# EAGLE board Board_1_ (EAGLE 8.7.0)
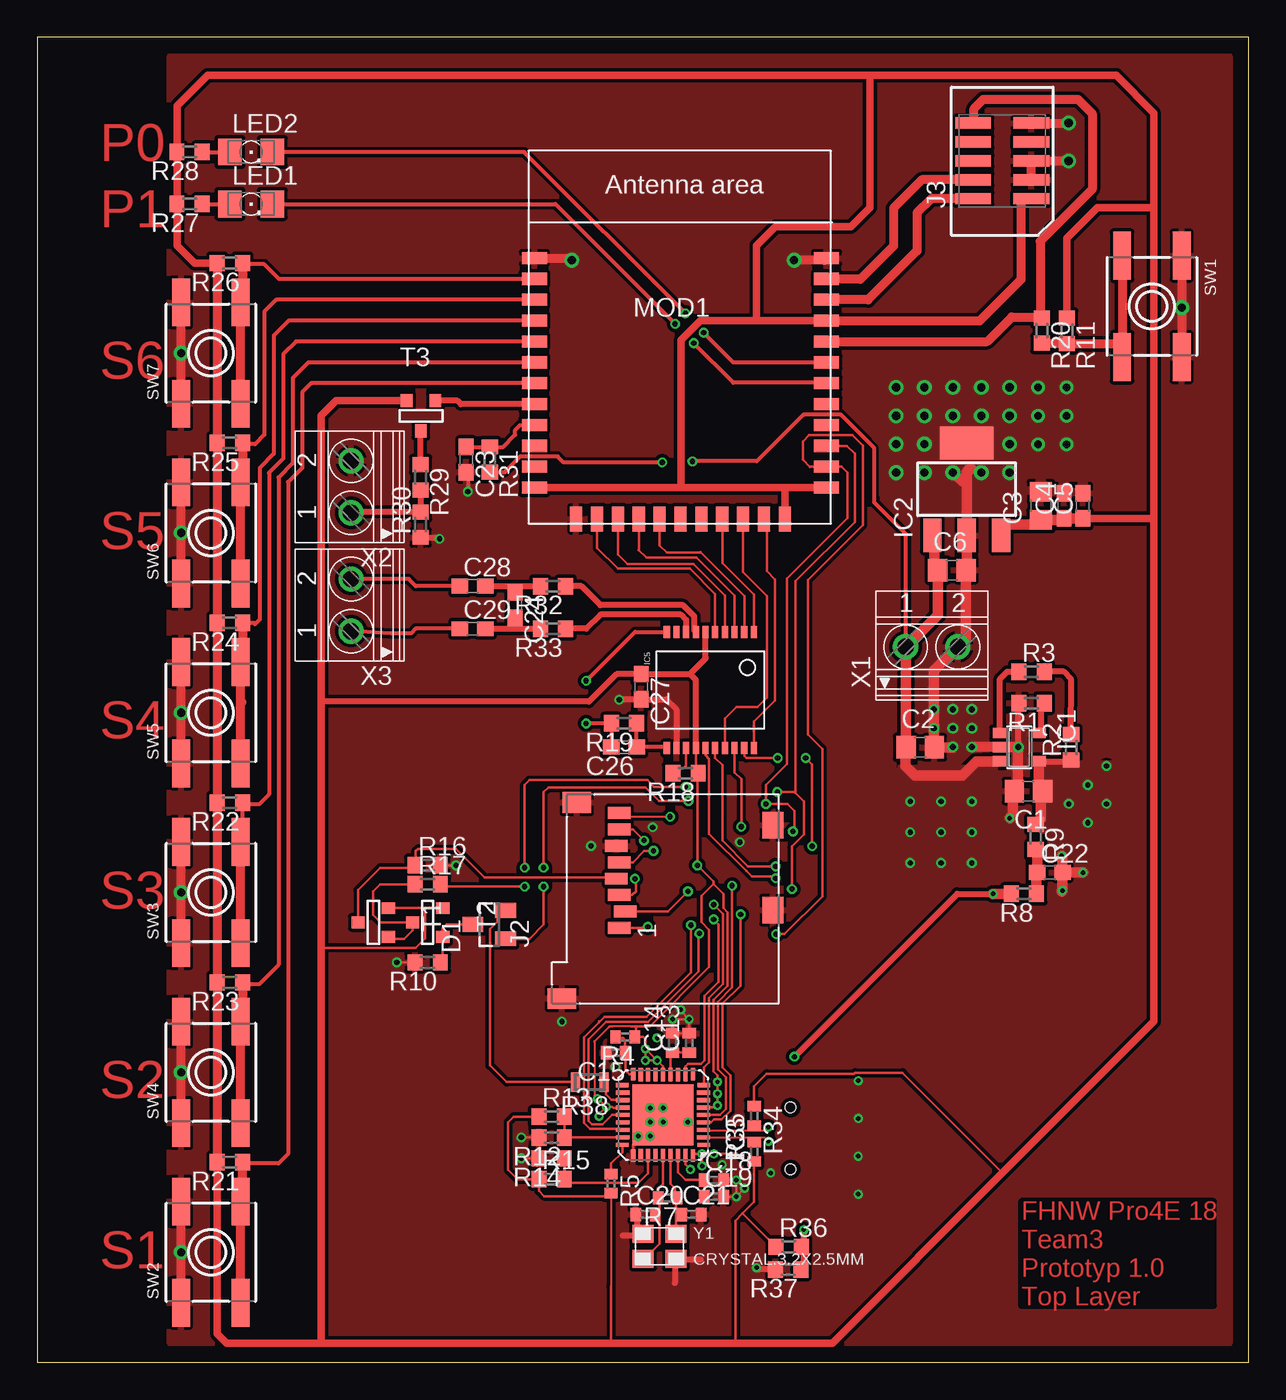
[diagram p0: board, top side]
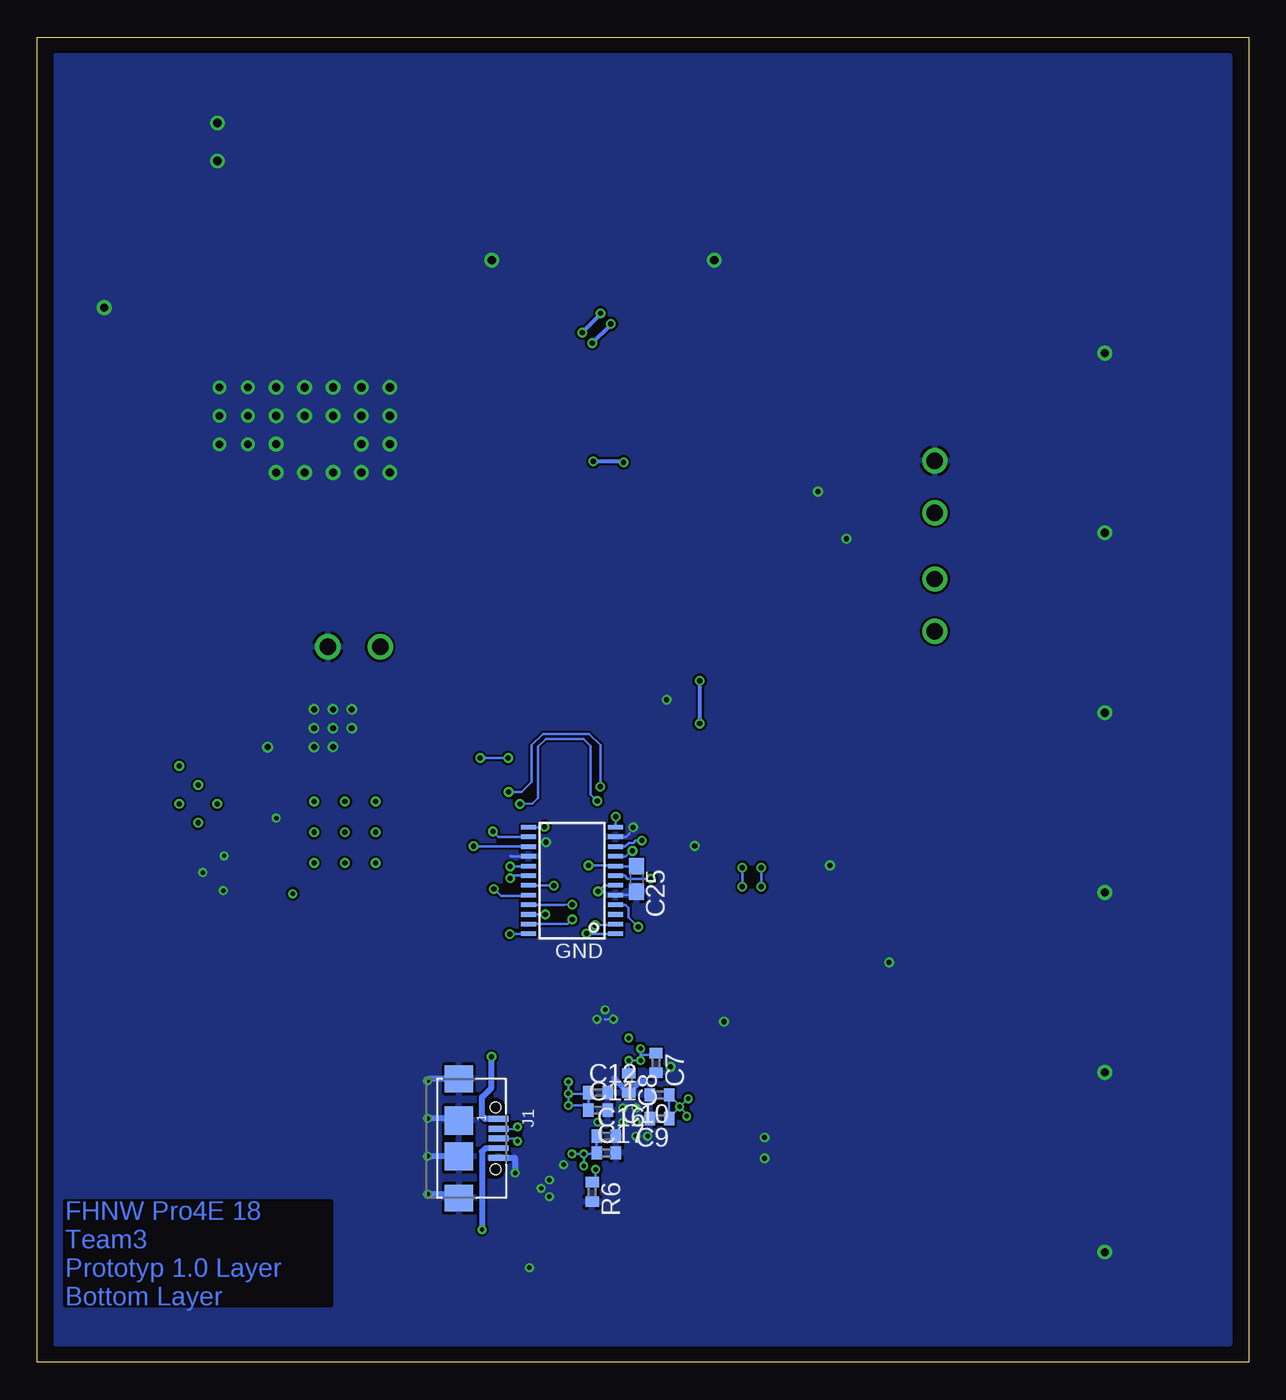
[diagram p1: board, bottom side, seen from below]

Size 81.28 x 88.9 mm. Coordinates in mm from the lower left corner, seen from the top.
Outline: 0,0 81.28,0 81.28,88.9 0,88.9 0,0
Copper layers (1*16): Top 0.035mm / dielectric 1.5mm / Bottom 0.035mm
Design rules "PCB-POOL Standard": minimum track width 0.15mm, minimum drill 0.3mm, track to track 0.15mm, track to pad 0.15mm, pad to pad 0.15mm, via to via 0.15mm, smd to smd 0.15mm, copper to edge 0.3mm, drill to drill 0.2mm, minimum pad ring 0.2mm, minimum via ring 0.15mm, stop-mask expansion 0.075mm, vias tented up to drill 0mil, thermal gap 0.2mm

## Footprints (pad centres in the part's own frame; a part is rotated, then mirrored left to right if it is on the bottom)
C0805 = smd 1.3 x 1.5: 1 -0.95,0; 2 0.95,0
C0603 = smd 1.1 x 1: 1 -0.85,0; 2 0.85,0
C0402 = smd 0.7 x 0.9: 1 -0.65,0; 2 0.65,0
SOT23 = smd 1 x 1.4: 1 -0.95,-1.1; 2 0.95,-1.1; 3 0,1.1
TSSOP24 = smd 0.305 x 0.991: 1 -3.575,-2.918; 2 -2.925,-2.918; 3 -2.275,-2.918; 4 -1.625,-2.918; 5 -0.975,-2.918; 6 -0.325,-2.918; 7 0.325,-2.918; 8 0.975,-2.918; 9 1.625,-2.918; 10 2.275,-2.918; 11 2.925,-2.918; 12 3.575,-2.918; 13 3.575,2.918; 14 2.925,2.918; 15 2.275,2.918; 16 1.625,2.918; 17 0.975,2.918; 18 0.325,2.918; 19 -0.325,2.918; 20 -0.975,2.918; 21 -1.625,2.918; 22 -2.275,2.918; 23 -2.925,2.918; 24 -3.575,2.918
SOT23-5 = smd 0.69 x 0.99: 1 -0.95,-1.29; 2 0,-1.29; 3 0.95,-1.29; 4 0.95,1.3; 5 -0.95,1.3
SOT223 = smd 1.219 x 2.235: 1 -2.311,-3.099; 2 0,-3.099; 3 2.311,-3.099 | smd 3.6 x 2.2: 4 0,3.099
QFN36-6X6 = smd 0.28 x 0.84: 1 -2,-2.735; 9 2,-2.735; 19 2,2.735; 27 -2,2.735 | smd 0.28 x 0.89: 2 -1.5,-2.71; 3 -1,-2.71; 4 -0.5,-2.71; 5 0,-2.71; 6 0.5,-2.71; 7 1,-2.71; 8 1.5,-2.71; 20 1.5,2.71; 21 1,2.71; 22 0.5,2.71; 23 0,2.71; 24 -0.5,2.71; 25 -1,2.71; 26 -1.5,2.71 | smd 0.84 x 0.28: 10 2.735,-2; 18 2.735,2; 28 -2.735,2; 36 -2.735,-2 | smd 0.89 x 0.28: 11 2.71,-1.5; 12 2.71,-1; 13 2.71,-0.5; 14 2.71,0; 15 2.71,0.5; 16 2.71,1; 17 2.71,1.5; 29 -2.71,1.5; 30 -2.71,1; 31 -2.71,0.5; 32 -2.71,0; 33 -2.71,-0.5; 34 -2.71,-1; 35 -2.71,-1.5 | smd 4.1 x 4.1: EXP 0,0
SSOP_20 = smd 0.813 x 0.406: 1 -3.9,2.925; 2 -3.9,2.275; 3 -3.9,1.625; 4 -3.9,0.975; 5 -3.9,0.325; 6 -3.9,-0.325; 7 -3.9,-0.975; 8 -3.9,-1.625; 9 -3.9,-2.275; 10 -3.9,-2.925; 11 3.9,-2.925; 12 3.9,-2.275; 13 3.9,-1.625; 14 3.9,-0.975; 15 3.9,-0.325; 16 3.9,0.325; 17 3.9,0.975; 18 3.9,1.625; 19 3.9,2.275; 20 3.9,2.925
629105136821 = smd 0.4 x 1.35: 1 -1.3,2.675; 2 -0.65,2.675; 3 0,2.675; 4 0.65,2.675; 5 1.3,2.675 | smd 1.8 x 1.9: SHELL -4,0; SHELL3 4,0 | smd 1.9 x 1.9: SHELL1 -1.2,0; SHELL2 1.2,0 | hole 0.7: -2.075,2.45; 2.075,2.45
693071010811 = smd 0.8 x 1.5: 1 0,0; 2 1.1,-0.4; 3 2.2,0; 4 3.3,0.2; 5 4.4,0; 6 5.5,0.2; 7 6.6,0; 8 7.7,0 | smd 1.4 x 1.9: 9 -4.75,3.85; 9-1 8.4,2.85 | smd 1.8 x 1.4: 10 1.19,-10.3; 10-1 6.89,-10.3
HDRV127P5X2-10_N = smd 0.76 x 2.4: 1 -2.54,-1.95; 2 -2.54,1.95; 3 -1.27,-1.95; 4 -1.27,1.95; 5 0,-1.95; 6 0,1.95; 7 1.27,-1.95; 8 1.27,1.95; 9 2.54,-1.95; 10 2.54,1.95
LED_1206 = smd 1.6 x 1.803: A -1.422,0; C 1.422,0
ACONNO_ACM_52832 = smd 1.676 x 0.813: 1 -9.8,8.4; 2 -9.8,7; 3 -9.8,5.6; 4 -9.8,4.2; 5 -9.8,2.8; 6 -9.8,1.4; 7 -9.8,0; 8 -9.8,-1.4; 9 -9.8,-2.8; 10 -9.8,-4.2; 11 -9.8,-5.6; 12 -9.8,-7; 24 9.8,-7; 25 9.8,-5.6; 26 9.8,-4.2; 27 9.8,-2.8; 28 9.8,-1.4; 29 9.8,0; 30 9.8,1.4; 31 9.8,2.8; 32 9.8,4.2; 33 9.8,5.6; 34 9.8,7; 35 9.8,8.4 | smd 0.813 x 1.676: 13 -7,-9.1; 14 -5.6,-9.1; 15 -4.2,-9.1; 16 -2.8,-9.1; 17 -1.4,-9.1; 18 0,-9.1; 19 1.4,-9.1; 20 2.8,-9.1; 21 4.2,-9.1; 22 5.6,-9.1; 23 7,-9.1
R0603 = smd 1 x 1.1: 1 -0.85,0; 2 0.85,0
R0402 = smd 0.7 x 0.9: 1 -0.65,0; 2 0.65,0
MINI_MELF-0102W = smd 0.6 x 1.3: 1 -0.95,0; 2 0.95,0
EVQ-Q2 = smd 3.2 x 1.2: A -3.4,-2; A' 3.4,-2; B -3.4,2; B' 3.4,2
SOT-23 = smd 0.787 x 0.889: 1 0.025,-1.016; 2 -0.94,1.016; 3 0.991,1.016
1751248 = drill 1.1 pad 1.7: 1 -1.75,-0.1; 2 1.75,-0.1
3.2X2.5MM = smd 1.4 x 1.2: 1 -1.1,-0.85; 2 1.1,-0.85; 3 1.1,0.85; 4 -1.1,0.85

## Placement (x,y rotation side)
C1  10u  [C0805]  66.51,38.32 180 top
C2  10u  [C0805]  59.25,41.26 0 top
C3  10u  [C0805]  67.34,57.46 90 top
C4  1u  [C0603]  68.9,57.46 90 top
C5  100n  [C0603]  70.14,57.46 90 top
C6  10u  [C0805]  61.37,53.14 0 top
C7  100n  [C0402]  39.77,20.08 270 bottom
C8  1n  [C0402]  41.59,18.73 270 bottom
C9  100n  [C0402]  39.53,16.35 180 bottom
C10  1n  [C0402]  39.53,17.94 180 bottom
C11  100n  [C0402]  43.66,16.91 0 bottom
C12  1n  [C0402]  43.66,18.1 0 bottom
C13  1u  [C0402]  43.74,21.43 90 top
C14  100n  [C0402]  42.62,21.43 90 top
C15  100n  [C0402]  38.81,20.76 180 top
C16  100n  [C0402]  43.1,15.16 0 bottom
C17  1n  [C0402]  43.1,14.05 0 bottom
C18  1u  [C0402]  45.4,12.22 0 top
C19  100n  [C0402]  45.4,11.11 0 top
C20  8p  [C0402]  40.8,9.92 0 top
C21  8p  [C0402]  43.89,9.92 0 top
C22  100n  [C0603]  67.94,32.86 0 top
C23  1u  [C0603]  28.78,60.57 270 top
C24  NP  [C0603]  32.07,50.8 270 top
C25  100n  [C0603]  41.07,32.43 270 bottom
C26  1n  [C0603]  39.37,41.27 180 top
C27  100n  [C0603]  40.53,45.33 270 top
C28  0R  [C0603]  29.21,52.07 0 top
C29  0R  [C0603]  29.21,49.21 0 top
D1  BAS40-05  [SOT23]  30.32,29.37 90 top
GND  TS3A27  [TSSOP24]  45.4,32.32 90 bottom
IC1  MCP73831  [SOT23-5]  65.89,41.27 270 top
IC2  LT1963EST-1.5  [SOT223]  62.36,58.58 0 top
IC3  VUB300  [QFN36-6X6]  41.99,16.59 90 top
IC5  WTV020SD-20S  [SSOP_20]  45.16,45.1 270 top
J1  [629105136821]  52.99,15.02 270 bottom
J2  [693071010811]  39.05,29.15 90 top
J3  DEBUG_CONNECTOR  [HDRV127P5X2-10_N]  64.75,80.61 90 top
LED1  [LED_1206]  14.35,77.71 0 top
LED2  [LED_1206]  14.35,81.2 0 top
MOD1  ACM_52832_VER2  [ACONNO_ACM_52832]  43.16,65.68 0 top
R1  2k  [R0603]  66.71,44.22 180 top
R2  NP  [R0603]  69.36,41.26 90 top
R3  NP  [R0603]  66.71,46.33 0 top
R4  100k  [R0402]  39.45,21.83 180 top
R5  NP  [R0402]  38.5,11.99 270 top
R6  12k  [R0402]  44.05,11.43 270 bottom
R7  1M  [R0402]  42.31,11.03 180 top
R8  Ferit Bead  [R0603]  66.2,31.43 180 top
R9  Ferit Bead  [R0603]  66.99,35.24 270 top
R10  470k  [R0603]  26.19,26.83 180 top
R11  10k  [R0603]  69.08,69.2 270 top
R12  1k  [R0603]  34.51,15.08 180 top
R13  NP  [R0603]  34.51,16.48 0 top
R14  1k  [R0603]  34.51,13.68 180 top
R15  NP  [R0603]  34.51,12.29 0 top
R16  470k  [R0603]  26.19,33.34 0 top
R17  470k  [R0603]  26.19,32.07 0 top
R18  150  [R0603]  43.5,39.53 180 top
R19  15k  [R0603]  39.37,42.86 180 top
R20  330R  [R0603]  67.41,69.22 270 top
R21  10k  [R0603]  12.92,13.42 180 top
R22  10k  [R0603]  12.92,37.55 180 top
R23  10k  [R0603]  12.92,25.48 180 top
R24  10k  [R0603]  12.92,49.61 180 top
R25  10k  [R0603]  12.92,61.68 180 top
R26  10k  [R0603]  12.92,73.74 180 top
R27  1k  [R0603]  10.22,77.71 180 top
R28  1k  [R0603]  10.22,81.2 180 top
R29  0R  [R0603]  25.72,59.37 270 top
R30  NP  [R0603]  25.72,56.2 90 top
R31  1k  [R0603]  30.37,60.57 270 top
R32  0R  [R0603]  34.61,52.07 180 top
R33  0R  [R0603]  34.61,49.21 180 top
R34  15k  [R0402]  48.1,16.54 270 top
R35  15k  [R0402]  48.1,14.13 90 top
R36  NP  [R0603]  50.42,7.75 0 top
R37  1k  [R0603]  50.39,6.22 180 top
R38  0R  [MINI_MELF-0102W]  37.07,18.8 180 top
SW1  SW_TACT_SMD  [EVQ-Q2]  74.79,70.84 270 top
SW2  SW_TACT_SMD  [EVQ-Q2]  11.65,7.39 90 top
SW3  SW_TACT_SMD  [EVQ-Q2]  11.65,31.52 90 top
SW4  SW_TACT_SMD  [EVQ-Q2]  11.65,19.45 90 top
SW5  SW_TACT_SMD  [EVQ-Q2]  11.65,43.58 90 top
SW6  SW_TACT_SMD  [EVQ-Q2]  11.65,55.65 90 top
SW7  SW_TACT_SMD  [EVQ-Q2]  11.65,67.71 90 top
T1  [SOT-23]  22.54,29.53 270 top
T2  [SOT-23]  26.19,29.53 270 top
T3  [SOT-23]  25.72,63.5 0 top
X1  1751248  [1751248]  60.02,48.09 0 top
X2  1751248  [1751248]  20.95,58.74 90 top
X3  1751248  [1751248]  20.95,50.8 90 top
Y1  CRYSTAL.3.2X2.5MM  [3.2X2.5MM]  41.75,7.78 0 top

## Library data of the parts
C1-C29 = rcl; SPICEPREFIX: C
D1 = diode
GND = TS3a27
IC1 = mcp73831
IC2 = linear-technology; MPN: LT1963EST-1.5; OC_FARNELL: 1663528; OC_NEWARK: 57M7534
IC3 = VUB300
IC5 = SparkFun-DigitalIC; PROD_#: NA; PROD_ID: IC-11012; SKU: NA; SPARKLE_ID: 6000
J1 = USBZueg
J2 = InputOutputIO (rev18a)(1)
J3 = Nordic_misc
LED1 LED2 = eagle-ltspice; SPICEMODEL: NONE; SPICEPREFIX: D; SPICETYPE: diode
MOD1 = acn52832_eagle
R1-R38 = resistor
SW1-SW7 = Pro3E
T1-T3 = zetex; OC_FARNELL: unknown; OC_NEWARK: unknown
X1-X3 = con-phoenix-350; OC_FARNELL: unknown; OC_NEWARK: unknown
Y1 = abracom

## Nets
+3V3: C3.1 C4.1 C5.1 C7.1 C8.1 C9.1 C10.1 C11.1 C12.1 C16.1 C17.1 C25.1 C27.1 GND.8 IC2.3 IC3.6 IC3.14 IC3.22 IC3.36 IC5.6 IC5.14 J3.1 MOD1.12 MOD1.23 MOD1.24 MOD1.32 R4.1 R5.2 R11.1 R13.1 R15.1 R18.1 R21.2 R22.2 R23.2 R24.2 R25.2 R26.2 R27.2 R28.2 R34.1 R35.1 R36.1 T1.2 T2.2 T3.2
+5V: C1.1 IC1.4 R2.1 R9.1
/EN: GND.20 MOD1.26 R17.2
BUSY: IC5.4 MOD1.15
CLK: GND.21 IC3.9
CMD: GND.23 IC3.11
D0: GND.19 IC3.5
D1: GND.22 IC3.4
D2: GND.2 IC3.25
D3: GND.1 IC3.23
D+: IC3.2 J1.3 R35.2
D-: IC3.3 J1.2 R34.2
DCLK: IC5.2 MOD1.17
DIN: IC5.3 MOD1.16
GND: C1.2 C2.2 C3.2 C4.2 C5.2 C6.2 C7.2 C8.2 C9.2 C10.2 C11.2 C12.2 C13.2 C14.2 C15.2 C16.2 C17.2 C18.2 C19.2 C20.1 C21.2 C22.2 C23.2 C25.2 C27.2 GND.5 GND.11 GND.16 IC1.2 IC2.2 IC2.4 IC3.28 IC3.EXP IC5.12 J1.5 J1.SHELL J1.SHELL1 J1.SHELL2 J1.SHELL3 J2.6 J2.9 J2.9-1 J2.10 J2.10-1 J3.3 J3.5 J3.9 MOD1.1 MOD1.13 MOD1.35 R1.2 R6.2 R10.2 R12.2 R14.2 R16.2 R30.1 R37.2 SW1.B SW1.B' SW2.B SW2.B' SW3.B SW3.B' SW4.B SW4.B' SW5.B SW5.B' SW6.B SW6.B' SW7.B SW7.B' X1.2 X2.2
IN: D1.1 GND.14 GND.24 MOD1.25
LED0: LED1.C MOD1.29
LED1: LED2.C MOD1.30
N$1: IC1.5 R1.1
N$2: R2.2 R3.2
N$3: IC1.1 R3.1
N$4: IC3.1
N$5: J1.4 R36.2 R37.1
N$6: MOD1.19
N$7: MOD1.18
N$8: D1.2 R38.2
N$9: GND.15 IC5.19
N$19: IC3.8
N$20: IC3.7
N$21: IC3.10
N$22: IC3.12
N$23: IC3.24
N$24: IC3.15
N$25: IC3.16
N$26: IC3.17
N$27: C15.1 IC3.18 R4.2
N$28: IC3.27 R5.1
N$29: IC3.19
N$30: IC3.20
N$31: IC3.35 R6.1
N$32: IC3.29
N$33: IC3.31
N$34: J1.1 R8.2
N$35: C20.2 IC3.32 R7.2 Y1.1
N$36: C21.1 IC3.33 R7.1 Y1.3
N$37: C22.1 R8.1 R9.2
N$38: GND.9 J2.5
N$39: IC5.13 R18.2
N$40: C26.1 IC5.11 R19.1
N$41: GND.17 IC5.16
N$42: GND.18 IC5.15
N$43: GND.4 J2.1
N$44: GND.12 J2.8
N$45: GND.6 J2.2
N$46: R17.1 T1.3 T2.1
N$47: GND.3
N$48: R11.2 R20.2 SW1.A SW1.A'
N$49: D1.3 R10.1 T2.3
N$50: J3.4 MOD1.34
N$52: J3.10 MOD1.31 R20.1
N$53: J3.2 MOD1.33
N$54: LED1.A R27.1
N$55: C23.1 MOD1.9 R31.1
N$56: C28.1 X3.2
N$57: C29.1 X3.1
N$58: C24.2 C29.2 R33.2
N$59: C24.1 C28.2 R32.2
N$61: LED2.A R28.1
N$63: R29.2 R30.2 X2.1
N$64: MOD1.8 T3.3
N$65: R29.1 T3.1
NCD: IC3.26 R12.1 R13.2
NCD1: J2.4 R16.1 T1.1
NEXT: IC5.20 MOD1.22
PLAY: IC5.5 MOD1.14
PREV: IC5.1 MOD1.20
PWM: C26.2 IC5.10 R19.2
PWR: IC3.21 R38.1
RESET: IC5.17 MOD1.21
SDCS: GND.13 IC5.18
SDDI: GND.7 J2.3
SDDO: GND.10 J2.7
SPK+: IC5.7 R32.1
SPK-: IC5.8 R33.1
TASTE0: MOD1.7 R21.1 SW2.A SW2.A'
TASTE1: MOD1.5 R22.1 SW3.A SW3.A'
TASTE2: MOD1.6 R23.1 SW4.A SW4.A'
TASTE3: MOD1.4 R24.1 SW5.A SW5.A'
TASTE4: MOD1.3 R25.1 SW6.A SW6.A'
TASTE5: MOD1.2 R26.1 SW7.A SW7.A'
V+: C2.1 C6.1 IC1.3 IC2.1 R31.2 X1.1
VDD18: C13.1 C14.1 IC3.13
VDD18PLL: C18.1 C19.1 IC3.34
WP: IC3.30 R14.1 R15.2

## Tracks (layer width: path | path; a pad name or v marks a point on that pad's centre or on a via)
+3V3  (via drill 0.3, 0.35)
  Top 0.15: R5.2 38.5,11.14 38.5,5.08 | 46.96,13.97 v45.4,13.97 | v37.6,17.68 37.39,17.89 37.39,21.51 | 39.85,22.54 38.58,22.54 | 39.93,22 R4.1
  Top 0.152: v45.4,13.97 v44.61,13.97 | v44.61,13.97 v44.61,13.18 | IC3.36 43.99,13.97 v44.61,13.97 | v45.64,17.22 v45.64,18.81 45.64,19.26 45.37,19.53 45.37,24.32 46.32,25.26 46.32,30.2 46.04,30.47 46.04,31.43 45.37,32.1 | v45.64,18.02 v45.64,17.22 | v45.64,17.22 45.51,17.09 IC3.6 | v40.8,21.03 v41.59,20.24 | v41.59,20.24 v40.8,20.24 v40.8,21.03 | v41.59,20.24 41.99,19.84 IC3.14 | v38.18,17.14 37.7,16.67 v37.7,16.51 | v37.6,17.68 v37.6,17.67 v38.18,17.14 | v38.18,17.14 38.58,17.14 38.66,17.07 39.26,17.07 IC3.22 | v40.8,21.03 40.8,21.67 40.64,21.83 R4.1 40.16,21.89 40.16,22.54 | 39.85,22.54 40.16,22.54 | 40.16,22.54 41.12,22.54 45.09,26.51 45.09,29.01 44.55,29.54 44.55,31.28 45.37,32.1 | 38.58,22.54 38.42,22.54 38.38,22.5 38.36,22.5 37.39,21.53 37.39,21.51 | R13.1 31.97,16.48 31.59,16.1 31.59,12.92 32.23,12.29 R15.1 33.66,11.49 34,11.14 38.5,11.14 | 47.32,9.98 46.83,9.49 46.83,1.43 46.99,1.27 | 47.32,9.98 48.1,10.76 R35.1 48.04,13.54 47.39,13.54 46.96,13.97 | R36.1 47.33,9.98 47.32,9.98 | 44.84,47.22 44.84,47.31 | IC5.14 44.19,39.69 R18.1 44.29,39.47 v44.29,33.34 45.37,32.26 45.37,32.1 | R34.1 48.1,18.52 48.94,19.36 54.81,19.36 54.87,19.42 58.05,19.42 64.77,12.7 | 38.5,5.08 38.5,1.27 38.1,1.27 | T2.2 26.04,30.47 | 26.04,30.47 T1.2 | 26.04,30.47 26.04,28.45 25.4,27.81 19.05,27.81
  Top 0.406: 43.8,46.18 C27.1 38.87,46.18 37.02,44.32 19.05,44.32 | 43.8,46.18 44.84,47.22 | 44.84,47.31 IC5.6 | IC5.14 44.19,45.78 43.8,46.18
  Top 0.508: R26.2 10.56,73.74 9.37,74.93 R27.2 R28.2 9.37,84.3 11.43,86.36 55.88,86.36 | T3.2 20.07,64.52 19.05,63.5 19.05,44.32 19.05,27.81 19.05,1.27 | 19.05,1.27 12.7,1.27 12.07,1.9 R21.2 | 19.05,1.27 38.1,1.27 46.99,1.27 53.34,1.27 64.77,12.7 74.93,22.86 74.93,56.61 | C5.1 74.93,56.61 | MOD1.12 43.18,58.68 | 43.18,58.68 50.16,58.68 | 50.16,58.68 MOD1.24 | MOD1.23 50.16,58.68 | 43.18,58.68 43.18,68.58 44.48,69.88 48.26,69.88 | 48.26,69.88 MOD1.32 | 74.93,56.61 74.93,77.47 | 74.93,77.47 71.12,77.47 69.08,75.43 R11.1 | 48.26,69.88 48.26,74.93 49.53,76.2 54.61,76.2 55.88,77.47 55.88,86.36 | 55.88,86.36 72.39,86.36 74.93,83.82 74.93,77.47
  Top 0.61: MOD1.32 63.24,69.88 66.02,72.67 66.02,78.07 J3.1 | R26.2 R25.2 R24.2 R22.2 R23.2 R21.2
  Top 0.711: 64.91,55.24 arc-90 IC2.3 64.67,56.2 67.34,56.2 C3.1 68.9,56.51 C4.1 C5.1
  Bottom 0.152: v38.18,17.14 C9.1 C10.1 38.18,17.24 v38.18,17.14 | 38.14,17.11 37.7,16.67 v37.7,16.51 | 38.14,17.11 v38.18,17.14 | v37.6,17.68 v37.6,17.67 v38.18,17.14 | 38.1,17.14 38.14,17.11 | C8.1 v41.59,20.24 v40.8,20.24 | C7.1 39.86,20.64 40.8,20.64 v40.8,20.24 | v45.64,17.22 v45.64,18.02 44.39,18.02 | v45.64,17.22 v45.64,18.81 | 44.39,18.02 C12.1 | v45.64,17.22 44.62,17.22 C11.1 44.31,17.94 44.39,18.02 | v44.61,13.97 43.83,13.97 C17.1 C16.1 | v40.8,20.24 v40.8,21.03 | v44.61,13.18 v44.61,13.97 | v44.61,13.97 v45.4,13.97 | C25.1 42.47,33.28 GND.8 42.53,33.34 v44.29,33.34
+5V  (via drill 0.35)
  Top 0.406: IC1.4 69.2,40.32 R2.1
  Top 0.711: IC1.4 67.19,38.72 C1.1 67.33,38.72 67.33,36.43 R9.1
  other vias: 71.75,40 70.48,38.73 69.22,37.46 71.75,37.46 70.48,36.2
  pour Top (no thermals): 67.47,35.56 67.47,40.32 72.39,40.32 72.39,35.56
/EN  (via drill 0.35)
  Top 0.152: R17.2 27.2,31.91 v32.7,31.91 | v32.7,33.18 32.7,38.73 33.02,39.05 40.96,39.05 41.4,38.61 v43.5,38.61 | v49.66,38.26 50.8,38.26 50.88,38.18 | 50.88,38.18 51.44,37.62 51.44,35.41 50.64,34.62 v50.64,31.75 | 50.88,38.18 50.88,52.4 54.86,56.39 54.86,60.96 54.34,61.48 MOD1.26
  Bottom 0.152: v32.7,31.91 v32.7,33.18 | v49.66,38.26 48.79,38.26 48.11,38.95 48.11,41.4 47.35,42.16 44.25,42.16 43.5,41.41 v43.5,38.61 | v50.64,31.75 50.16,31.27 48.39,31.27 GND.20
BUSY
  Top 0.152: MOD1.15 38.96,54.18 39.6,53.54 44.05,53.54 46.14,51.45 IC5.4
CLK  (via drill 0.35)
  Top 0.152: IC3.9 44.72,19.77 45.07,20.12 45.07,24.44 46.02,25.39 46.02,30.07 v45.38,30.7
  Bottom 0.152: v45.38,30.7 45.94,30.7 GND.21
CMD  (via drill 0.35)
  Top 0.152: IC3.11 43.5,19.84 43.66,20 44.53,20 44.77,20.24 44.77,24.57 45.71,25.51 45.71,29.38 v45.38,29.71
  Bottom 0.152: v45.38,29.71 45.7,29.4 GND.23
D0  (via drill 0.35)
  Top 0.152: IC3.5 45.8,16.59 46.2,16.99 46.2,19.13 45.67,19.65 45.67,24.19 46.62,25.14 46.62,30.32 v46.62,31.97 46.62,31.28
  Bottom 0.152: v46.62,31.97 46.65,32 GND.19
D1  (via drill 0.35)
  Top 0.152: IC3.4 45.22,16.09 45.42,16.29 45.92,16.29 46.5,16.86 46.5,19.26 45.98,19.78 45.98,24.07 47.17,25.26 47.17,28.7 47.17,29.79 | 47.17,29.79 v47.2,30.04 arc90 47.17,30.02 47.17,29.79
  Bottom 0.152: v47.2,30.04 47.4,30.05 GND.22
D2  (via drill 0.35)
  Top 0.152: 37.7,22.81 37.7,22.86 | 37.7,22.81 36.69,21.8 36.69,16.07 37.1,15.65 39.22,15.65 IC3.25 | 37.7,22.81 38.05,23.16 40.88,23.16 43.86,26.14 v43.86,29.33
  Bottom 0.152: v43.86,29.33 42.55,29.33 GND.2
D3  (via drill 0.35)
  Top 0.152: IC3.23 38.58,16.59 37.94,15.95 37.23,15.95 36.99,16.19 36.99,21.67 38.16,22.85 40.99,22.85 44.37,26.22 44.37,28.7 44.49,28.7 44.49,28.77
  Top 0.254: v44.42,28.77 44.49,28.7
  Bottom 0.152: GND.1 44.41,28.75 v44.42,28.77
D+  (via drill 0.3)
  Top 0.15: IC3.2 48.1,15.09 | 48.1,15.09 48.79,15.09 v49.05,14.83 | R35.2 48.1,15.09
  Top 0.152: IC3.2 arc90 IC3.2
  Bottom 0.15: J1.3 49.24,15.02 v49.05,14.83
D-  (via drill 0.3)
  Top 0.15: 44.73,15.56 48.16,15.56 | 48.16,15.56 48.83,15.56 v49.05,15.78 | R34.2 48.16,15.83 48.16,15.56
  Top 0.152: IC3.3 arc90 44.73,15.56
  Bottom 0.15: J1.2 49.17,15.67 v49.05,15.78
DCLK
  Top 0.152: MOD1.17 41.76,54.81 42.24,54.33 44.48,54.33 44.5,54.36 47.44,51.42 IC5.2
DIN
  Top 0.152: IC5.3 46.79,51.44 44.25,53.97 40.87,53.97 40.34,54.51 40.36,54.53 MOD1.16
GND  (via drill 0.3, 0.35, 0.4, 0.5, 0.55)
  Top 0.152: v42.62,23.02 C14.2 C13.2 v43.74,23.02 | 43.18,23.57 v43.18,23.65 | v42.62,23.02 43.18,23.57 | v43.74,23.02 43.18,23.57 | v46.91,11.11 v46.91,12.22 | v46.91,12.22 C18.2 C19.2 v46.91,11.11 | v46.91,11.11 v47.47,11.67 v46.91,12.22 | v42.62,23.02 v43.74,23.02 | IC3.28 39.99,14.59 40.32,14.92 v40.32,15.16 | R12.2 v32.48,15.08 | R14.2 v32.48,13.68 | 42.86,43.81 42.89,43.79 | R10.2 v24.13,26.83 | R16.2 v28.1,33.34 | C15.2 38.16,20.43
  Top 0.254: C23.2 28.89,59.6 v28.89,58.42
  Top 0.406: R1.2 65.78,43.74 65.78,41.27 | 42.78,5.32 42.78,6.91 44.53,6.91 | 40.72,8.49 40.24,8.49 | 40.24,8.49 39.29,8.49 | 40.08,9.76 40.24,9.76 40.24,8.49 | R37.2 48.39,6.22 v48.26,6.35 | 42.86,43.81 42.2,44.48 C27.2 39.08,44.48 v39.05,44.45 | 42.89,43.79 IC5.12 | R30.1 26.89,55.35 v26.99,55.24
  Top 0.61: SW1.B v76.79,70.76 SW1.B' | J3.3 J3.5 v69.2,80.61 | J3.9 v69.2,83.15 | MOD1.1 35.71,74.08 v35.86,73.94 | MOD1.35 52.82,73.94 v50.78,73.94 | SW2.B v9.65,7.38 SW2.B' | SW3.B v9.65,31.52 SW3.B' | SW4.B v9.65,19.45 SW4.B' | SW5.B v9.65,43.58 SW5.B' | SW6.B v9.65,55.64 SW6.B' | SW7.B v9.65,67.71 SW7.B'
  Top 0.686: IC1.2 v62.71,41.27 | 62.36,58.84 v61.44,59.69
  Top 0.711: IC1.2 65.78,41.27 65.78,38.72 C1.2 65.47,38.72 65.47,36.73 v65.25,36.51 | v61.44,41.29 61.44,41.26 C2.2 60.17,41.26 v60.17,42.54 60.17,46.4 X1.2 62.32,48.55 C6.2 62.36,53.18 IC2.2 62.36,58.84 62.36,59.62 arc-90 62.67,59.92 | C22.2 v70.17,32.86 | C22.2 68.8,33.92 v68.74,33.97 | C22.2 v68.8,31.65 68.74,31.59
  Bottom 0.152: 42.55,23.02 v42.62,23.02 43.18,23.02 | 42.7,23.26 42.62,23.26 | C25.2 41.3,31.35 GND.5 | GND.11 41.79,35.25 41.55,35.48 | GND.16 49.49,33.95 49.53,33.98
  Bottom 0.406: J1.SHELL 54.96,19.02 v55.09,18.89 | J1.SHELL3 53.24,11.27 v55.09,11.27 | J1.SHELL2 53.5,13.82 | 53.5,13.82 v55.08,13.82 v55.09,13.81 | J1.SHELL1 53.12,16.35 v55.09,16.35 | 53.4,13.72 53.5,13.82 | J1.5 49.28,13.72 49.21,13.65 v49.21,12.7 | 40.66,18.77 40.66,18.82 40.64,18.85 40.83,18.85 C8.2 42.57,19.06 42.57,19.08
  other vias: 62.71,42.54 61.44,42.54 62.71,43.81 61.44,43.81 60.17,43.81 57.63,59.69 57.63,61.59 57.63,63.5 57.63,65.41 59.53,59.69 59.53,61.59 59.53,63.5 59.53,65.41 61.44,63.5 61.44,65.41 63.34,63.5 63.34,65.41 65.25,65.41 65.25,63.5 67.15,65.41 67.15,63.5 67.15,61.59 65.25,61.59 65.25,59.69 63.34,59.69 65.82,41.27 69.06,61.59 69.06,63.5 69.06,65.41 43.66,16.11 41.99,16.11 41.99,17.07 41.12,17.07 41.12,16.11 41.12,15.16 45.96,13.26 47.14,34.9 38.79,19.81 35.2,22.86 41.3,35.89 37.16,34.65
  pour Top: 59.54,44.44 63.35,44.44 63.35,40.95 59.54,40.95
  pour Top (no thermals): 70.33,66.99 70.33,60.01 64.93,60.01 64.93,58.42 56.36,58.42 56.36,66.99
  pour Top (isolate 1.016): 70.33,60.01 64.93,60.01 64.93,58.42 70.33,58.42
  pour Bottom: 40.8,20.24 41.59,20.24 41.59,21.03 40.8,21.03
  pour Top (isolate 0.229): 8.89,87.63 80.01,87.63 80.01,1.27 8.89,1.27
  pour Bottom (isolate 0.127): 1.27,87.63 80.01,87.63 80.01,1.27 1.27,1.27
IN  (via drill 0.35)
  Top 0.152: D1.1 33.02,28.42 33.97,29.37 v33.97,31.91 | v33.97,33.18 33.97,38.26 34.29,38.58 40.8,38.58 41.71,37.67 42.02,37.67 v43.7,37.66 | v50.7,35.62 50.8,35.56 50.8,36.99 50.33,37.46 v48.9,37.46 48.9,38.73 50.29,40.13 50.29,52.58 54.36,56.64 54.36,59.69 53.96,60.08 MOD1.25 51.85,60.08 51.84,60.07 51.36,60.55 51.36,61.77 51.79,62.2 54.69,62.2 55.4,61.49 55.4,56.16 51.71,52.48 51.71,42.11 52.68,41.15 52.68,31.27 50.14,28.73 v49.58,28.73
  Bottom 0.152: v33.97,31.91 v33.97,33.18 | v48.9,37.46 v48.89,37.46 48.05,37.49 47.68,37.87 47.68,41.3 47.14,41.83 44.63,41.83 44.15,41.35 44.15,38.11 v43.7,37.66 | GND.14 48.69,35.24 50.33,35.24 v50.7,35.62 | GND.24 49.56,28.75 v49.58,28.73
LED0  (via drill 0.35)
  Top 0.254: LED1.C 34.76,77.71 v42.8,69.67 | MOD1.29 52.92,65.72 46.7,65.72 v44.04,68.38
  Bottom 0.254: v44.04,68.38 42.8,69.62 v42.8,69.67
LED1  (via drill 0.35)
  Top 0.254: LED2.C 15.86,81.19 32.68,81.19 v43.48,70.38 | v44.71,69.08 46.71,67.08 MOD1.30
  Bottom 0.254: v44.71,69.08 43.48,70.31 v43.48,70.38
N$1
  Top 0.406: R1.1 67.33,43.74 67.33,42.22 | 67.33,42.19 67.33,42.22 | 67.33,42.22 IC1.5
N$2
  Top 0.406: R2.2 69.37,45.8 68.89,46.33 R3.2
N$3
  Top 0.406: IC1.1 64.6,45.85 65.08,46.33 R3.1
N$5  (via drill 0.3)
  Top 0.406: R36.2 51.44,7.91 | 51.44,7.91 v51.44,8.89 | R37.1 51.44,6.42 51.44,7.91
  Bottom 0.406: J1.4 51.2,14.37 51.44,14.13 v51.44,8.89
N$8
  Top 0.152: R38.2 31.5,18.8 30.38,19.91 30.38,29.06 30.89,29.57 30.89,29.97 30.86,30 31.1,30 D1.2
N$9  (via drill 0.35)
  Top 0.152: v52,34.62 51.99,34.56 51.99,40.11 v51.56,40.54 | v49.68,40.54 47.57,40.54 47.44,40.68 IC5.19
  Bottom 0.152: v51.56,40.54 v49.68,40.54 | v52,34.62 51.98,34.6 GND.15
N$27
  Top 0.152: R4.2 38.88,21.75 39.29,21.75 39.45,21.59 39.45,20.65 C15.1 39.46,19.59 39.73,19.32 IC3.18
N$28
  Top 0.152: R5.1 38.5,13.33 39.25,14.09 IC3.27
N$31  (via drill 0.3)
  Top 0.152: IC3.35 43.49,13.26 v43.81,12.94
  Bottom 0.152: v43.81,12.94 43.81,12.32 arc90 R6.1
N$34  (via drill 0.3, 0.35)
  Top 0.406: v50.8,20.5 61.73,31.43 v64.14,31.43
  Top 0.711: R8.2 v64.14,31.43
  Bottom 0.406: J1.1 51.24,16.32 51.44,16.51 51.44,17.78 50.8,18.42 v50.8,20.5
N$35
  Top 0.152: 41.66,11.11 R7.2 41.74,11.03 | 41.66,11.11 41.66,11.65 41.99,11.99 IC3.32 | 41.2,7.38 41.1,7.38 Y1.1 40.74,6.93 41.75,7.94 41.75,9.92 | 41.75,9.92 41.75,11.02 41.74,11.03 | 41.74,11.03 41.66,11.11 | C20.2 41.75,9.92
N$36
  Top 0.152: IC3.33 42.49,11.96 42.78,11.67 42.78,11.21 R7.1 arc90 42.85,10.93 42.85,9.92 | 42.85,9.92 Y1.3 | C21.1 42.85,9.92
  Top 0.254: 42.73,8.83 Y1.3
N$37
  Top 0.711: R8.1 67.05,32.81 C22.1 67.09,34.29 R9.2
N$38  (via drill 0.35)
  Top 0.152: J2.5 39.97,33.55 40.72,34.3 v41.34,34.3
  Bottom 0.152: v41.34,34.3 41.46,34.3 41.81,33.95 GND.9
N$39
  Top 0.152: R18.2 42.97,39.85 43.34,39.85 43.54,40.04 IC5.13
N$40
  Top 0.254: IC5.11 42.16,41.27 C26.1 R19.1
N$41  (via drill 0.35)
  Top 0.152: v49.55,33.27 47.7,33.27 45.96,35 45.96,40.08 45.49,40.56 IC5.16
  Bottom 0.152: v49.55,33.27 48.35,33.27 GND.17
N$42  (via drill 0.35)
  Top 0.152: v49.55,32.47 49.41,32.61 48.08,32.61 47.95,32.61 47.59,32.96 47.57,32.96 45.09,35.45 45.09,40.48 44.84,40.73 IC5.15
  Bottom 0.152: v49.55,32.47 49.37,32.65 GND.18
N$43  (via drill 0.35)
  Top 0.152: J2.1 40.89,29.15 v40.96,29.21
  Bottom 0.152: v40.96,29.21 41.59,29.85 41.59,30.48 41.81,30.7 GND.4
N$44  (via drill 0.35)
  Top 0.152: v42.46,36.6 39.27,36.63 J2.8
  Bottom 0.152: GND.12 42.46,36.55 v42.46,36.6
N$45  (via drill 0.35)
  Top 0.152: J2.2 42.31,30.25 v43.66,31.59
  Bottom 0.152: v43.66,31.59 43.25,32 GND.6
N$46
  Top 0.152: T1.3 23.68,28.42 24.61,28.42 25.18,28.99 T2.1 23.04,29.5 22.54,30 22.54,31.59 23.02,32.07 R17.1
N$48
  Top 0.61: R20.2 69.07,68.36 R11.2 72.56,68.35 72.79,68.12 SW1.A' SW1.A
N$49
  Top 0.152: R10.1 27.21,27 T2.3 27.21,29.11 27.46,29.37 D1.3
N$50
  Top 0.61: J3.4 59.35,79.34 57.45,77.43 57.45,74.89 55.23,72.67 55.21,72.68 MOD1.34
N$51  (via drill 0.3)
  other vias: 41.59,21.75
N$52
  Top 0.61: MOD1.31 63.74,68.48 65.39,70.13 67.34,70.13 | 67.34,70.13 R20.1 | J3.10 62.85,83.19 62.85,84.1 63.48,84.73 69.83,84.73 70.78,83.78 70.78,78.7 67.29,75.21 67.29,70.18 67.34,70.13
N$53
  Top 0.61: J3.2 59.99,78.07 59.04,77.11 59.04,74.57 55.75,71.28 MOD1.33
N$54
  Top 0.254: R27.1 LED1.A
N$55
  Top 0.254: C23.1 R31.1 31.25,61.42 32.07,62.23 32.07,62.55 32.38,62.86 33.34,62.86 MOD1.9
N$56
  Top 0.254: C28.1 25.4,52.07 24.92,52.55 X3.2
N$57
  Top 0.254: C29.1 25.4,49.21 25.08,48.89 23.75,48.89 X3.1
N$58
  Top 0.406: C29.2 32.07,49.21 | 32.07,49.21 R33.2 | C24.2 32.07,49.21
N$59
  Top 0.406: C28.2 32.07,52.07 | 32.07,52.07 R32.2 | C24.1 32.07,52.07
N$61
  Top 0.254: R28.1 LED2.A
N$63
  Top 0.406: X2.1 21.11,57.05 R30.2 R29.2
N$64
  Top 0.406: MOD1.8 28.43,64.28 28.19,64.52 T3.3
N$65
  Top 0.406: R29.1 25.72,62.46 T3.1
NCD
  Top 0.152: R13.2 R12.1 IC3.26
NCD1
  Top 0.152: T1.1 21.53,31.69 23.02,33.18 25.18,33.18 R16.1 25.4,33.39 25.4,34.29 25.56,34.45 28.1,34.45 30,32.54 38.76,32.54 J2.4
NEXT
  Top 0.152: IC5.20 48.09,42.98 49.51,44.4 49.51,52.53 48.95,53.09 48.95,56.4 MOD1.22
PLAY
  Top 0.152: 37.74,57.35 MOD1.14 37.56,54.63 38.96,53.24 43.79,53.24 45.49,51.54 IC5.5
PREV
  Top 0.152: MOD1.20 45.96,53.63 48.09,51.51 IC5.1
PWM  (via drill 0.35)
  Top 0.254: C26.2 R19.2 v36.83,42.86 | v36.83,45.72 40.11,49 IC5.10
  Bottom 0.254: v36.83,42.86 v36.83,45.72
PWR
  Top 0.152: 39.25,17.62 arc-90 IC3.21 38.55,17.59 38.15,17.98 38.15,18.67 arc90 R38.1
RESET
  Top 0.152: MOD1.21 47.36,53.02 48.97,51.41 48.97,44.6 48.34,43.97 46.92,43.97 46.14,43.18 IC5.17
SDCS  (via drill 0.35)
  Top 0.152: 47.26,35.96 v47.24,35.93 47.24,39.12 46.79,39.57 IC5.18
  Bottom 0.152: v47.24,35.93 47.28,35.9 GND.13
SDDI  (via drill 0.35)
  Top 0.152: J2.3 39.92,31.35 40.16,31.59 40.16,32.37 v40.1,32.44
  Bottom 0.152: v40.1,32.44 41.67,32.44 41.89,32.65 GND.7
SDDO  (via drill 0.35)
  Top 0.152: J2.7 39.97,35.75 v40.71,35
  Bottom 0.152: v40.71,35 41.14,35 41.29,34.86 41.57,34.86 41.83,34.6 GND.10
SPK+
  Top 0.406: IC5.7 44.09,49.1 44.09,50.04 43.33,50.8 37.78,50.8 36.51,52.07 R32.1
SPK-
  Top 0.406: R33.1 36.83,49.21 37.78,50.16 43.18,50.16 43.54,49.81 IC5.8
TASTE0
  Top 0.254: MOD1.7 18.38,65.68 17.78,65.09 17.78,60.01 16.83,59.05 16.83,13.97 16.19,13.33 14.09,13.33 13.77,13.02
  Top 0.61: SW2.A SW2.A' 13.77,10.9 13.77,13.02 R21.1
TASTE1
  Top 0.254: MOD1.5 17.37,68.48 16.51,67.63 16.51,60.64 15.56,59.69 15.56,38.1 14.92,37.46 13.86,37.46 R22.1 13.77,35.03 SW3.A'
  Top 0.61: SW3.A SW3.A'
TASTE2
  Top 0.254: MOD1.6 18.19,67.08 17.14,66.04 17.14,60.33 16.19,59.37 16.19,26.67 14.92,25.4 13.86,25.4 R23.1
  Top 0.61: SW4.A SW4.A' 13.77,22.97 R23.1
TASTE3
  Top 0.254: MOD1.4 16.86,69.88 15.88,68.9 15.88,60.96 14.92,60.01 14.92,49.85 14.61,49.53 14.52,49.61 R24.1
  Top 0.61: SW5.A 13.65,44.21 | 13.65,44.21 13.65,46.75 | 13.65,46.75 SW5.A' | R24.1 13.77,46.88 13.65,46.75 | 13.72,44.29 13.65,44.21
TASTE4
  Top 0.254: MOD1.3 16.04,71.28 15.24,70.48 15.24,62.23 14.61,61.59 13.77,61.59
  Top 0.61: R25.1 13.77,61.59 13.77,59.16 SW6.A' SW6.A 13.72,52.18 13.72,51.36 13.92,51.56 | 33.25,71.4 MOD1.3
TASTE5
  Top 0.254: MOD1.2 16.22,72.68 15.24,73.66 13.86,73.66 R26.1
  Top 0.61: SW7.A 13.65,70.88 | 13.65,70.88 SW7.A' | R26.1 13.77,71 13.65,70.88
V+  (via drill 0.35)
  Top 0.254: R31.2 31.36,59.72 32.41,60.77 34.92,60.77 35.32,60.38 v41.94,60.38 | v43.97,60.45 48.28,60.45 51.41,63.58 51.42,63.57 53.91,63.57 56.16,61.32 56.16,57.68 58.27,55.57 X1.1
  Top 0.711: 58.3,47.99 C2.1 58.26,41.22 58.26,40 58.9,39.37 62.07,39.37 63.02,40.32 IC1.3 | 58.3,47.99 X1.1 | 58.3,47.99 60.42,50.12 C6.1 60.42,53.46 arc90 60.18,53.7 60.18,54.63 arc-90 60.05,54.76 IC2.1
  Bottom 0.254: v43.97,60.45 42.01,60.45 v41.94,60.38
  other vias: 58.58,37.62 60.64,37.62 62.71,37.62 58.58,35.56 60.64,35.56 62.71,35.56 62.71,33.5 60.64,33.5 58.58,33.5
  pour Top (no thermals): 57.78,40 64.37,40 64.37,32.62 57.78,32.62
VDD18
  Top 0.152: IC3.13 42.49,20.65 C14.1 C13.1
VDD18PLL
  Top 0.152: IC3.34 42.99,12.73 43.5,12.22 C18.1 C19.1
WP
  Top 0.152: R14.1 R15.2 35.62,12.03 40.35,12.03 40.99,12.67 IC3.30

## Text on the board
Top: P0 | P1 | S6 | S5 | S4 | S3 | S2 | S1 | FHNW Pro4E 18 / Team3 / Prototyp 1.0 / Top Layer
Bottom: FHNW Pro4E 18 / Team3 / Prototyp 1.0 Layer / Bottom Layer